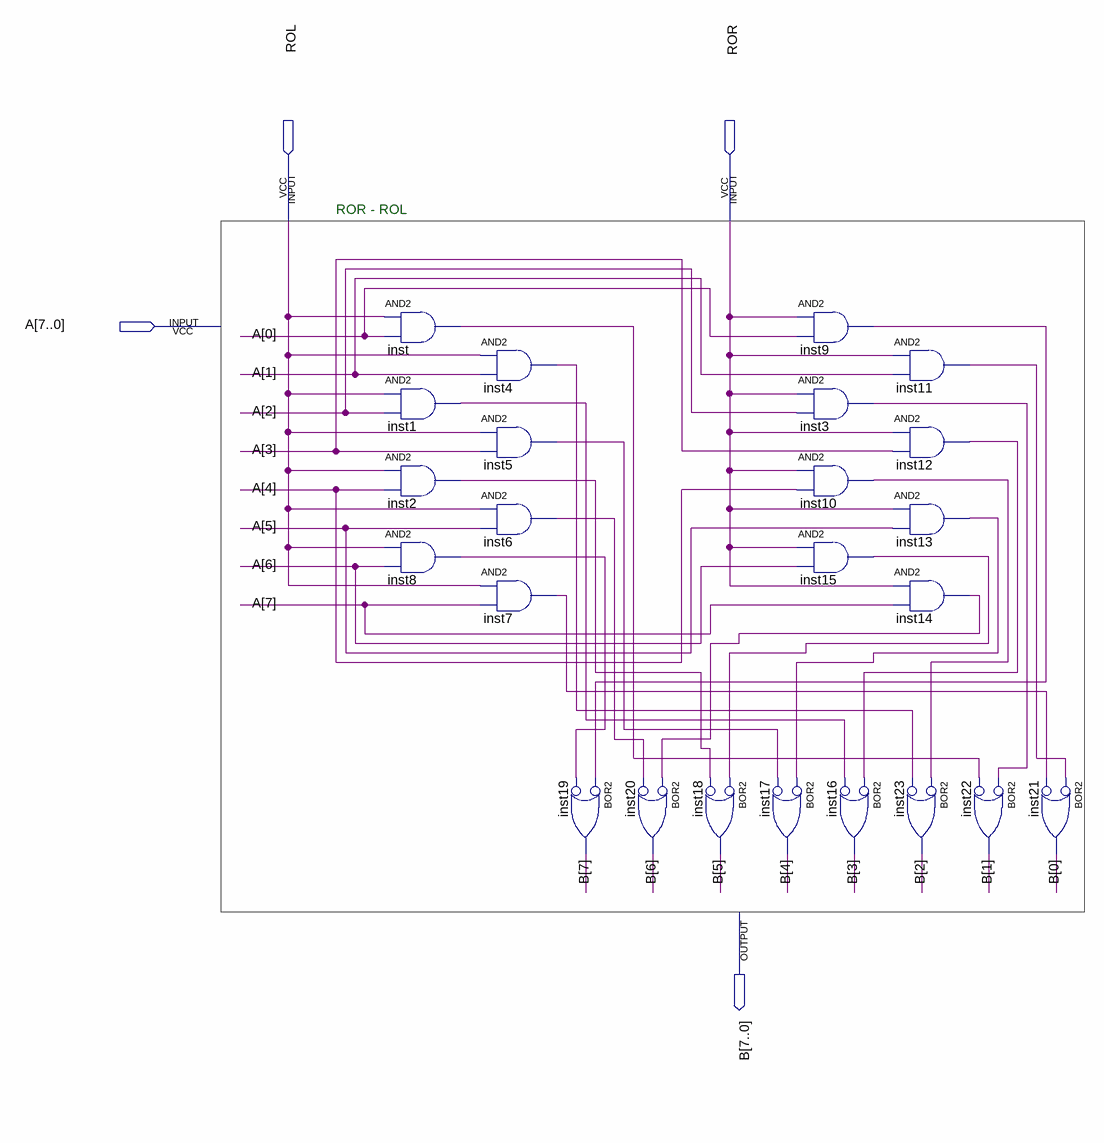
[diagram p0: schematic sheet]
// Quartus schematic 8-bit-rot.bdf as structural Verilog: 24 symbols, 4 pins
module \8-bit-rot  (
  input  ROL,
  input  ROR,
  input  [7:0] A,
  output [7:0] B
);

  wire inst1_out, inst2_out, inst3_out, inst4_out, inst5_out, inst6_out, inst7_out, inst8_out, inst9_out,
       inst10_out, inst11_out, inst12_out, inst13_out, inst14_out, inst15_out, inst_out;

  and inst (inst_out, ROL, A[0]);
  and inst1 (inst1_out, ROL, A[2]);
  and inst2 (inst2_out, ROL, A[4]);
  and inst8 (inst8_out, ROL, A[6]);
  and inst4 (inst4_out, ROL, A[1]);
  and inst5 (inst5_out, ROL, A[3]);
  and inst6 (inst6_out, ROL, A[5]);
  and inst7 (inst7_out, ROL, A[7]);
  or inst19 (B[7], ~inst9_out, ~inst8_out);  // BOR2
  or inst20 (B[6], ~inst14_out, ~inst6_out);  // BOR2
  or inst18 (B[5], ~inst15_out, ~inst2_out);  // BOR2
  or inst17 (B[4], ~inst13_out, ~inst5_out);  // BOR2
  and inst9 (inst9_out, ROR, A[0]);
  and inst3 (inst3_out, ROR, A[2]);
  and inst10 (inst10_out, ROR, A[4]);
  and inst15 (inst15_out, ROR, A[6]);
  or inst16 (B[3], ~inst12_out, ~inst1_out);  // BOR2
  and inst11 (inst11_out, ROR, A[1]);
  and inst12 (inst12_out, ROR, A[3]);
  and inst13 (inst13_out, ROR, A[5]);
  and inst14 (inst14_out, ROR, A[7]);
  or inst23 (B[2], ~inst10_out, ~inst4_out);  // BOR2
  or inst22 (B[1], ~inst3_out, ~inst_out);  // BOR2
  or inst21 (B[0], ~inst11_out, ~inst7_out);  // BOR2

  // Notes on the sheet:
  //   ROR - ROL
endmodule
